# EAGLE schematic I2C16RJ45 (EAGLE 9.5.0)

## Sheet 1 of 2
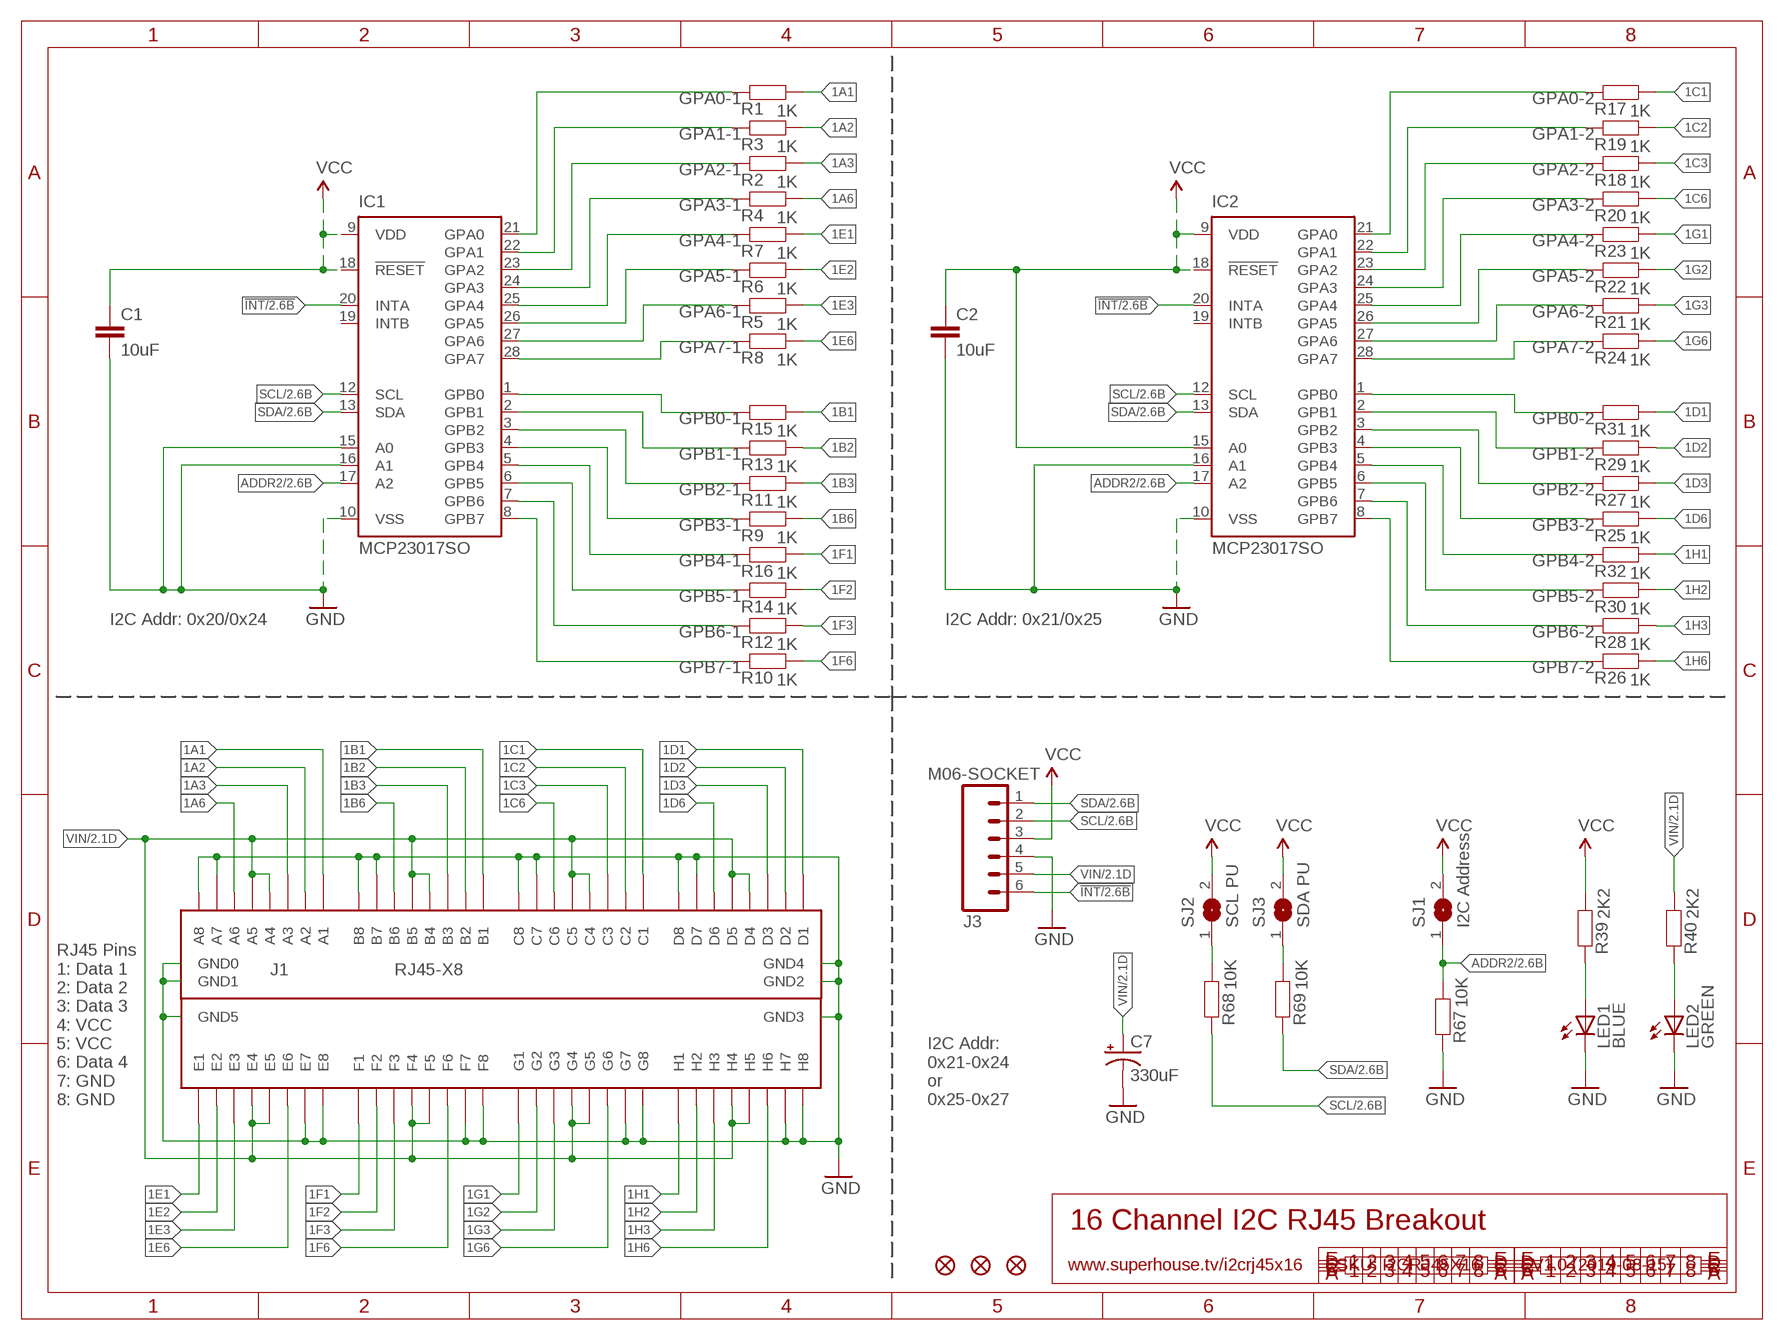
[diagram p0: schematic, sheet 1]

### Parts
C1  10uF  CAP0805  [C0805]
C2  10uF  CAP0805  [C0805]
C7  330uF  CAP_POLG  [PANASONIC_G]
FID1  FIDUCIAL1X2.5  [FIDUCIAL-1X2.5]
FID2  FIDUCIAL1X2.5  [FIDUCIAL-1X2.5]
FID3  FIDUCIAL1X2.5  [FIDUCIAL-1X2.5]
IC1  MCP23017SO  [SO28W]
IC2  MCP23017SO  [SO28W]
J1  RJ45-X8  [RJ45-2X4]
J3  M06-SOCKET  [1X06-S]
LED1  BLUE  LED0603  [LED-0603]
LED2  GREEN  LED0603  [LED-0603]
R1  1K  RESISTOR0603  [R0603]
R2  1K  RESISTOR0603  [R0603]
R3  1K  RESISTOR0603  [R0603]
R4  1K  RESISTOR0603  [R0603]
R5  1K  RESISTOR0603  [R0603]
R6  1K  RESISTOR0603  [R0603]
R7  1K  RESISTOR0603  [R0603]
R8  1K  RESISTOR0603  [R0603]
R9  1K  RESISTOR0603  [R0603]
R10  1K  RESISTOR0603  [R0603]
R11  1K  RESISTOR0603  [R0603]
R12  1K  RESISTOR0603  [R0603]
R13  1K  RESISTOR0603  [R0603]
R14  1K  RESISTOR0603  [R0603]
R15  1K  RESISTOR0603  [R0603]
R16  1K  RESISTOR0603  [R0603]
R17  1K  RESISTOR0603  [R0603]
R18  1K  RESISTOR0603  [R0603]
R19  1K  RESISTOR0603  [R0603]
R20  1K  RESISTOR0603  [R0603]
R21  1K  RESISTOR0603  [R0603]
R22  1K  RESISTOR0603  [R0603]
R23  1K  RESISTOR0603  [R0603]
R24  1K  RESISTOR0603  [R0603]
R25  1K  RESISTOR0603  [R0603]
R26  1K  RESISTOR0603  [R0603]
R27  1K  RESISTOR0603  [R0603]
R28  1K  RESISTOR0603  [R0603]
R29  1K  RESISTOR0603  [R0603]
R30  1K  RESISTOR0603  [R0603]
R31  1K  RESISTOR0603  [R0603]
R32  1K  RESISTOR0603  [R0603]
R39  2K2  RESISTOR0603  [R0603]
R40  2K2  RESISTOR0603  [R0603]
R67  10K  RESISTOR0603  [R0603]
R68  10K  RESISTOR0603  [R0603]
R69  10K  RESISTOR0603  [R0603]
SJ1  I2C Address  SJ-NORMAL  [SJ]
SJ2  SCL PU  SJ-NORMAL  [SJ]
SJ3  SDA PU  SJ-NORMAL  [SJ]

### Nets
1A1: J1.A1 R1.2
1A2: J1.A2 R3.2
1A3: J1.A3 R2.2
1A6: J1.A6 R4.2
1B1: J1.B1 R15.2
1B2: J1.B2 R13.2
1B3: J1.B3 R11.2
1B6: J1.B6 R9.2
1C1: J1.C1 R17.2
1C2: J1.C2 R19.2
1C3: J1.C3 R18.2
1C6: J1.C6 R20.2
1D1: J1.D1 R31.2
1D2: J1.D2 R29.2
1D3: J1.D3 R27.2
1D6: J1.D6 R25.2
1E1: J1.E1 R7.2
1E2: J1.E2 R6.2
1E3: J1.E3 R5.2
1E6: J1.E6 R8.2
1F1: J1.F1 R16.2
1F2: J1.F2 R14.2
1F3: J1.F3 R12.2
1F6: J1.F6 R10.2
1G1: J1.G1 R23.2
1G2: J1.G2 R22.2
1G3: J1.G3 R21.2
1G6: J1.G6 R24.2
1H1: J1.H1 R32.2
1H2: J1.H2 R30.2
1H3: J1.H3 R28.2
1H6: J1.H6 R26.2
!INT: IC1.20(INTA) IC2.20(INTA) J3.6 ; also sheet 2
ADDR2: IC1.17(A2) IC2.17(A2) R67.2 SJ1.1 ; also sheet 2
GND: C1.2 C2.2 C7.- IC1.10(VSS) IC1.15(A0) IC1.16(A1) IC2.10(VSS) IC2.16(A1) J1.A7 J1.A8 J1.B7 J1.B8 J1.C7 J1.C8 J1.D7 J1.D8 J1.E7 J1.E8 J1.F7 J1.F8 J1.G7 J1.G8 J1.GND0 J1.GND1 J1.GND2 J1.GND3 J1.GND4 J1.GND5 J1.H7 J1.H8 J3.4 LED1.C LED2.C R67.1 ; also sheet 2
GPA0-1: IC1.21(GPA0) R1.1
GPA0-2: IC2.21(GPA0) R17.1
GPA1-1: IC1.22(GPA1) R3.1
GPA1-2: IC2.22(GPA1) R19.1
GPA2-1: IC1.23(GPA2) R2.1
GPA2-2: IC2.23(GPA2) R18.1
GPA3-1: IC1.24(GPA3) R4.1
GPA3-2: IC2.24(GPA3) R20.1
GPA4-1: IC1.25(GPA4) R7.1
GPA4-2: IC2.25(GPA4) R23.1
GPA5-1: IC1.26(GPA5) R6.1
GPA5-2: IC2.26(GPA5) R22.1
GPA6-1: IC1.27(GPA6) R5.1
GPA6-2: IC2.27(GPA6) R21.1
GPA7-1: IC1.28(GPA7) R8.1
GPA7-2: IC2.28(GPA7) R24.1
GPB0-1: IC1.1(GPB0) R15.1
GPB0-2: IC2.1(GPB0) R31.1
GPB1-1: IC1.2(GPB1) R13.1
GPB1-2: IC2.2(GPB1) R29.1
GPB2-1: IC1.3(GPB2) R11.1
GPB2-2: IC2.3(GPB2) R27.1
GPB3-1: IC1.4(GPB3) R9.1
GPB3-2: IC2.4(GPB3) R25.1
GPB4-1: IC1.5(GPB4) R16.1
GPB4-2: IC2.5(GPB4) R32.1
GPB5-1: IC1.6(GPB5) R14.1
GPB5-2: IC2.6(GPB5) R30.1
GPB6-1: IC1.7(GPB6) R12.1
GPB6-2: IC2.7(GPB6) R28.1
GPB7-1: IC1.8(GPB7) R10.1
GPB7-2: IC2.8(GPB7) R26.1
N$1: R68.2 SJ2.1
N$2: R69.2 SJ3.1
N$7: LED1.A R39.1
N$8: LED2.A R40.1
SCL: IC1.12(SCL) IC2.12(SCL) J3.2 R68.1 ; also sheet 2
SDA: IC1.13(SDA) IC2.13(SDA) J3.1 R69.1 ; also sheet 2
VCC: C1.1 C2.1 IC1.9(VDD) IC1.18(!RESET) IC2.9(VDD) IC2.15(A0) IC2.18(!RESET) J3.3 R39.2 SJ1.2 SJ2.2 SJ3.2 ; also sheet 2
VIN: C7.+ J1.A4 J1.A5 J1.B4 J1.B5 J1.C4 J1.C5 J1.D4 J1.D5 J1.E4 J1.E5 J1.F4 J1.F5 J1.G4 J1.G5 J1.H4 J1.H5 J3.5 R40.2 ; also sheet 2
Unconnected: IC1.19(INTB) IC2.19(INTB)

### Notes on the sheet
- I2C Addr: 0x20/0x24 | I2C Addr: 0x21/0x25
- RJ45 Pins
  1: Data 1
  2: Data 2
  3: Data 3
  4: VCC
  5: VCC
  6: Data 4
  7: GND
  8: GND
- I2C Addr:
  0x21-0x24
  or
  0x25-0x27
- 16 Channel I2C RJ45 Breakout
- www.superhouse.tv/i2crj45x16 | SKU: I2CRJ45X16 | V1.0 (2019-08-15)

## Sheet 2 of 2
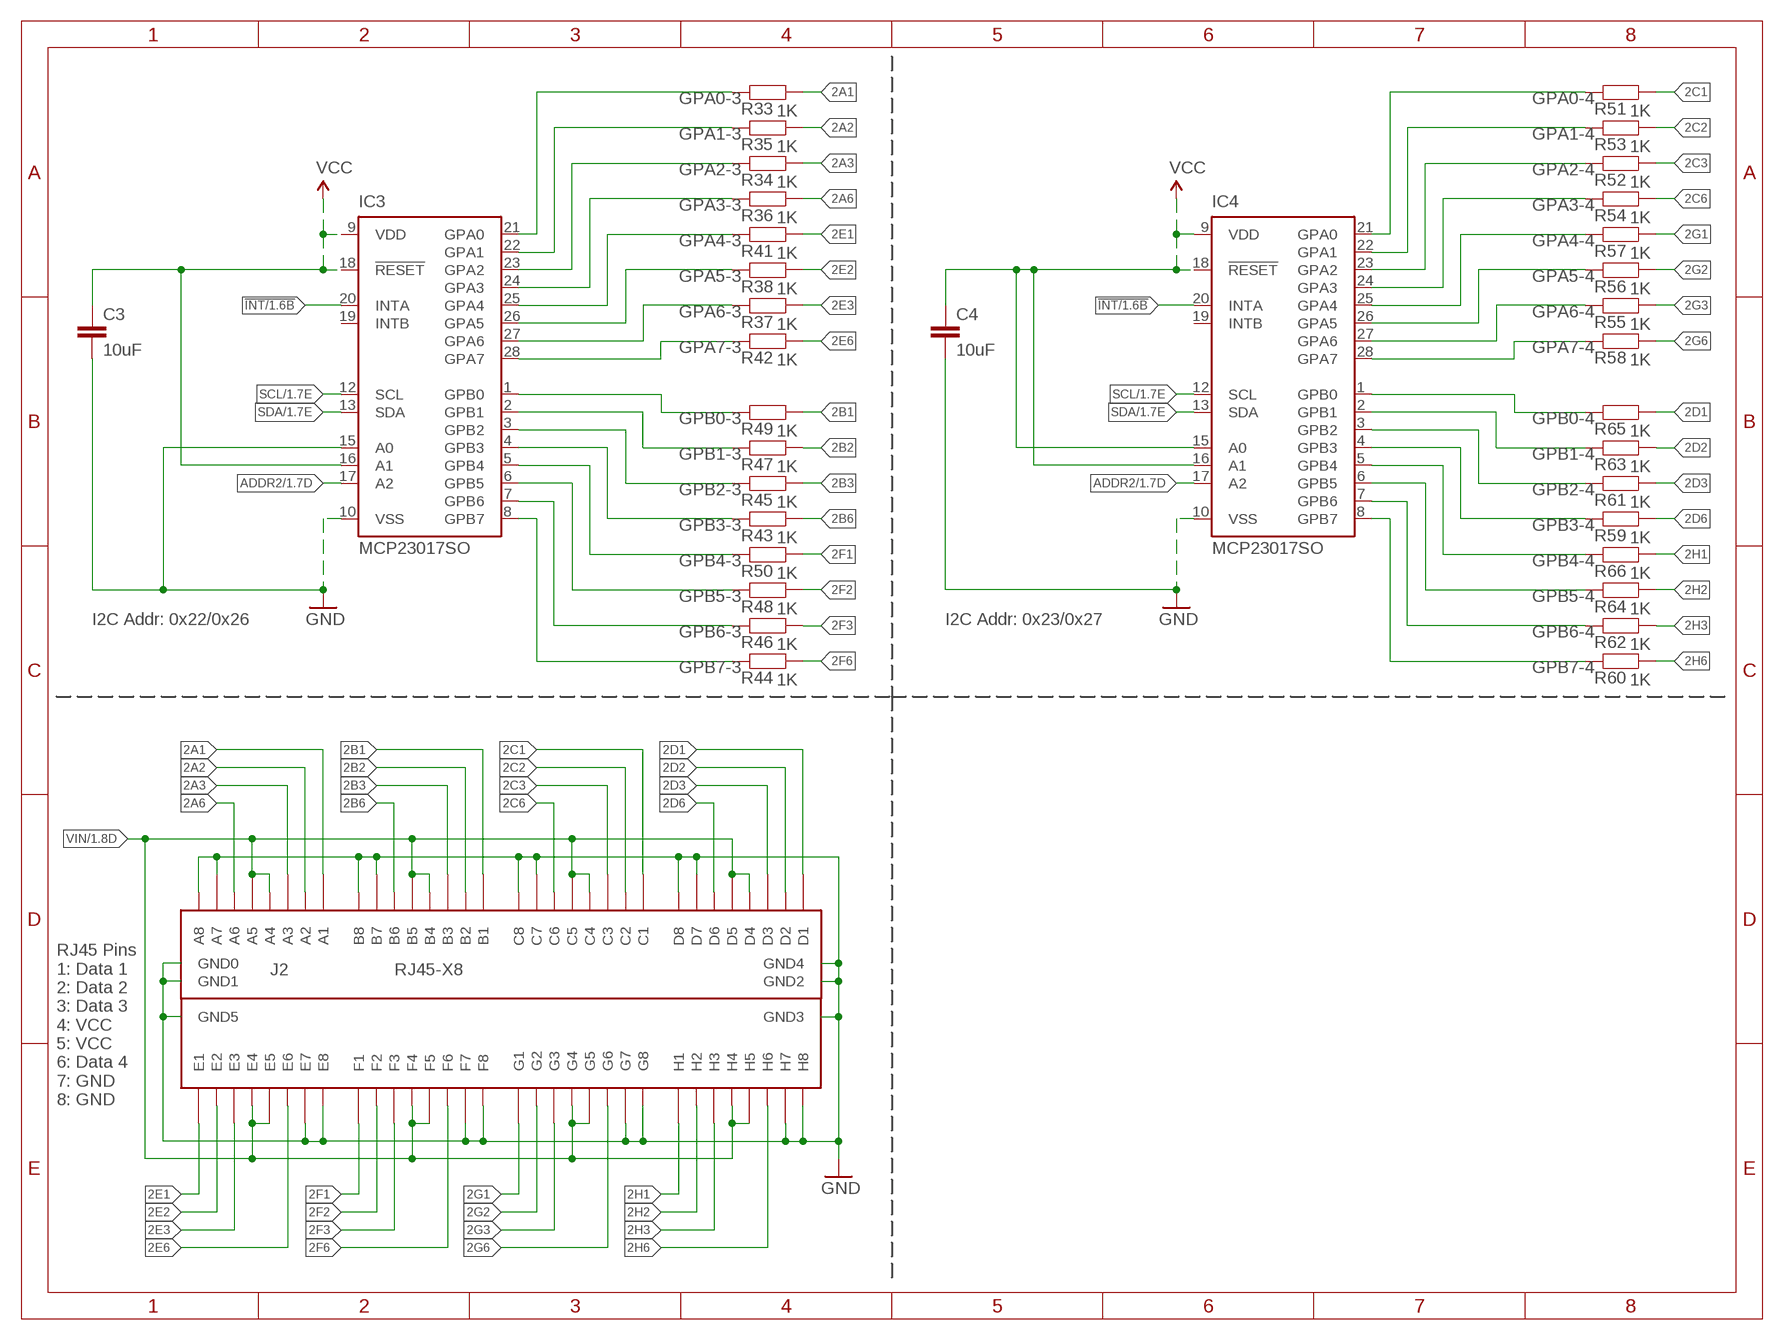
[diagram p1: schematic, sheet 2]

### Parts
C3  10uF  CAP0805  [C0805]
C4  10uF  CAP0805  [C0805]
IC3  MCP23017SO  [SO28W]
IC4  MCP23017SO  [SO28W]
J2  RJ45-X8  [RJ45-2X4]
R33  1K  RESISTOR0603  [R0603]
R34  1K  RESISTOR0603  [R0603]
R35  1K  RESISTOR0603  [R0603]
R36  1K  RESISTOR0603  [R0603]
R37  1K  RESISTOR0603  [R0603]
R38  1K  RESISTOR0603  [R0603]
R41  1K  RESISTOR0603  [R0603]
R42  1K  RESISTOR0603  [R0603]
R43  1K  RESISTOR0603  [R0603]
R44  1K  RESISTOR0603  [R0603]
R45  1K  RESISTOR0603  [R0603]
R46  1K  RESISTOR0603  [R0603]
R47  1K  RESISTOR0603  [R0603]
R48  1K  RESISTOR0603  [R0603]
R49  1K  RESISTOR0603  [R0603]
R50  1K  RESISTOR0603  [R0603]
R51  1K  RESISTOR0603  [R0603]
R52  1K  RESISTOR0603  [R0603]
R53  1K  RESISTOR0603  [R0603]
R54  1K  RESISTOR0603  [R0603]
R55  1K  RESISTOR0603  [R0603]
R56  1K  RESISTOR0603  [R0603]
R57  1K  RESISTOR0603  [R0603]
R58  1K  RESISTOR0603  [R0603]
R59  1K  RESISTOR0603  [R0603]
R60  1K  RESISTOR0603  [R0603]
R61  1K  RESISTOR0603  [R0603]
R62  1K  RESISTOR0603  [R0603]
R63  1K  RESISTOR0603  [R0603]
R64  1K  RESISTOR0603  [R0603]
R65  1K  RESISTOR0603  [R0603]
R66  1K  RESISTOR0603  [R0603]

### Nets
2A1: J2.A1 R33.2
2A2: J2.A2 R35.2
2A3: J2.A3 R34.2
2A6: J2.A6 R36.2
2B1: J2.B1 R49.2
2B2: J2.B2 R47.2
2B3: J2.B3 R45.2
2B6: J2.B6 R43.2
2C1: J2.C1 R51.2
2C2: J2.C2 R53.2
2C3: J2.C3 R52.2
2C6: J2.C6 R54.2
2D1: J2.D1 R65.2
2D2: J2.D2 R63.2
2D3: J2.D3 R61.2
2D6: J2.D6 R59.2
2E1: J2.E1 R41.2
2E2: J2.E2 R38.2
2E3: J2.E3 R37.2
2E6: J2.E6 R42.2
2F1: J2.F1 R50.2
2F2: J2.F2 R48.2
2F3: J2.F3 R46.2
2F6: J2.F6 R44.2
2G1: J2.G1 R57.2
2G2: J2.G2 R56.2
2G3: J2.G3 R55.2
2G6: J2.G6 R58.2
2H1: J2.H1 R66.2
2H2: J2.H2 R64.2
2H3: J2.H3 R62.2
2H6: J2.H6 R60.2
!INT: IC3.20(INTA) IC4.20(INTA) ; also sheet 1
ADDR2: IC3.17(A2) IC4.17(A2) ; also sheet 1
GND: C3.2 C4.2 IC3.10(VSS) IC3.15(A0) IC4.10(VSS) J2.A7 J2.A8 J2.B7 J2.B8 J2.C7 J2.C8 J2.D7 J2.D8 J2.E7 J2.E8 J2.F7 J2.F8 J2.G7 J2.G8 J2.GND0 J2.GND1 J2.GND2 J2.GND3 J2.GND4 J2.GND5 J2.H7 J2.H8 ; also sheet 1
GPA0-3: IC3.21(GPA0) R33.1
GPA0-4: IC4.21(GPA0) R51.1
GPA1-3: IC3.22(GPA1) R35.1
GPA1-4: IC4.22(GPA1) R53.1
GPA2-3: IC3.23(GPA2) R34.1
GPA2-4: IC4.23(GPA2) R52.1
GPA3-3: IC3.24(GPA3) R36.1
GPA3-4: IC4.24(GPA3) R54.1
GPA4-3: IC3.25(GPA4) R41.1
GPA4-4: IC4.25(GPA4) R57.1
GPA5-3: IC3.26(GPA5) R38.1
GPA5-4: IC4.26(GPA5) R56.1
GPA6-3: IC3.27(GPA6) R37.1
GPA6-4: IC4.27(GPA6) R55.1
GPA7-3: IC3.28(GPA7) R42.1
GPA7-4: IC4.28(GPA7) R58.1
GPB0-3: IC3.1(GPB0) R49.1
GPB0-4: IC4.1(GPB0) R65.1
GPB1-3: IC3.2(GPB1) R47.1
GPB1-4: IC4.2(GPB1) R63.1
GPB2-3: IC3.3(GPB2) R45.1
GPB2-4: IC4.3(GPB2) R61.1
GPB3-3: IC3.4(GPB3) R43.1
GPB3-4: IC4.4(GPB3) R59.1
GPB4-3: IC3.5(GPB4) R50.1
GPB4-4: IC4.5(GPB4) R66.1
GPB5-3: IC3.6(GPB5) R48.1
GPB5-4: IC4.6(GPB5) R64.1
GPB6-3: IC3.7(GPB6) R46.1
GPB6-4: IC4.7(GPB6) R62.1
GPB7-3: IC3.8(GPB7) R44.1
GPB7-4: IC4.8(GPB7) R60.1
SCL: IC3.12(SCL) IC4.12(SCL) ; also sheet 1
SDA: IC3.13(SDA) IC4.13(SDA) ; also sheet 1
VCC: C3.1 C4.1 IC3.9(VDD) IC3.16(A1) IC3.18(!RESET) IC4.9(VDD) IC4.15(A0) IC4.16(A1) IC4.18(!RESET) ; also sheet 1
VIN: J2.A4 J2.A5 J2.B4 J2.B5 J2.C4 J2.C5 J2.D4 J2.D5 J2.E4 J2.E5 J2.F4 J2.F5 J2.G4 J2.G5 J2.H4 J2.H5 ; also sheet 1
Unconnected: IC3.19(INTB) IC4.19(INTB)

### Notes on the sheet
- I2C Addr: 0x22/0x26 | I2C Addr: 0x23/0x27
- RJ45 Pins
  1: Data 1
  2: Data 2
  3: Data 3
  4: VCC
  5: VCC
  6: Data 4
  7: GND
  8: GND

## Library data of the parts
C1-C4 = SuperHouse-DiscreteSemi:CAP: Capacitor Standard ceramic capacitor
C7 = SuperHouse-DiscreteSemi:CAP_POL: Capacitor Polarized These are standard SMD and PTH capacitors. Normally 10uF, 47uF, and 100uF in electrolytic and tantalum varieties. Always verify the external diameter of the through hole cap, it varies with capacity, voltage, and manufacturer. The EIA devices should be standard.
FID1-FID3 = freetronics:FIDUCIAL: Fiducial Alignment Points Various fiducial points for machine vision alignment.
IC1-IC4 = SuperHouse-ICs:MCP23017: http://ww1.microchip.com/downloads/en/DeviceDoc/21952a.pdf Source: http://ww1.microchip.com/downloads/en/DeviceDoc/21952a.pdf
J1 J2 = SuperHouse-Connectors:RJ45-X8: 8-way RJ45 socket, PCB mount. 2 rows of 4.
J3 = SuperHouse-Connectors:M06: 6-way header Standard 1x6 header, and screw terminal variations
LED1 LED2 = SuperHouse-LEDs:LED: LEDs Standard schematic elements and footprints for 5mm, 3mm, 1206, and 0603 sized LEDs. 5mm - Spark Fun Electronics SKU : COM-00529 (and others)
R1-R69 = SuperHouse-DiscreteSemi:RESISTOR: Resistor Standard resistors.
SJ1-SJ3 = SuperHouse-Jumpers:SJ: SMD solder jumper, normally-open. Add solder to close the connection.